# EAGLE schematic main (EAGLE 8.0.2)
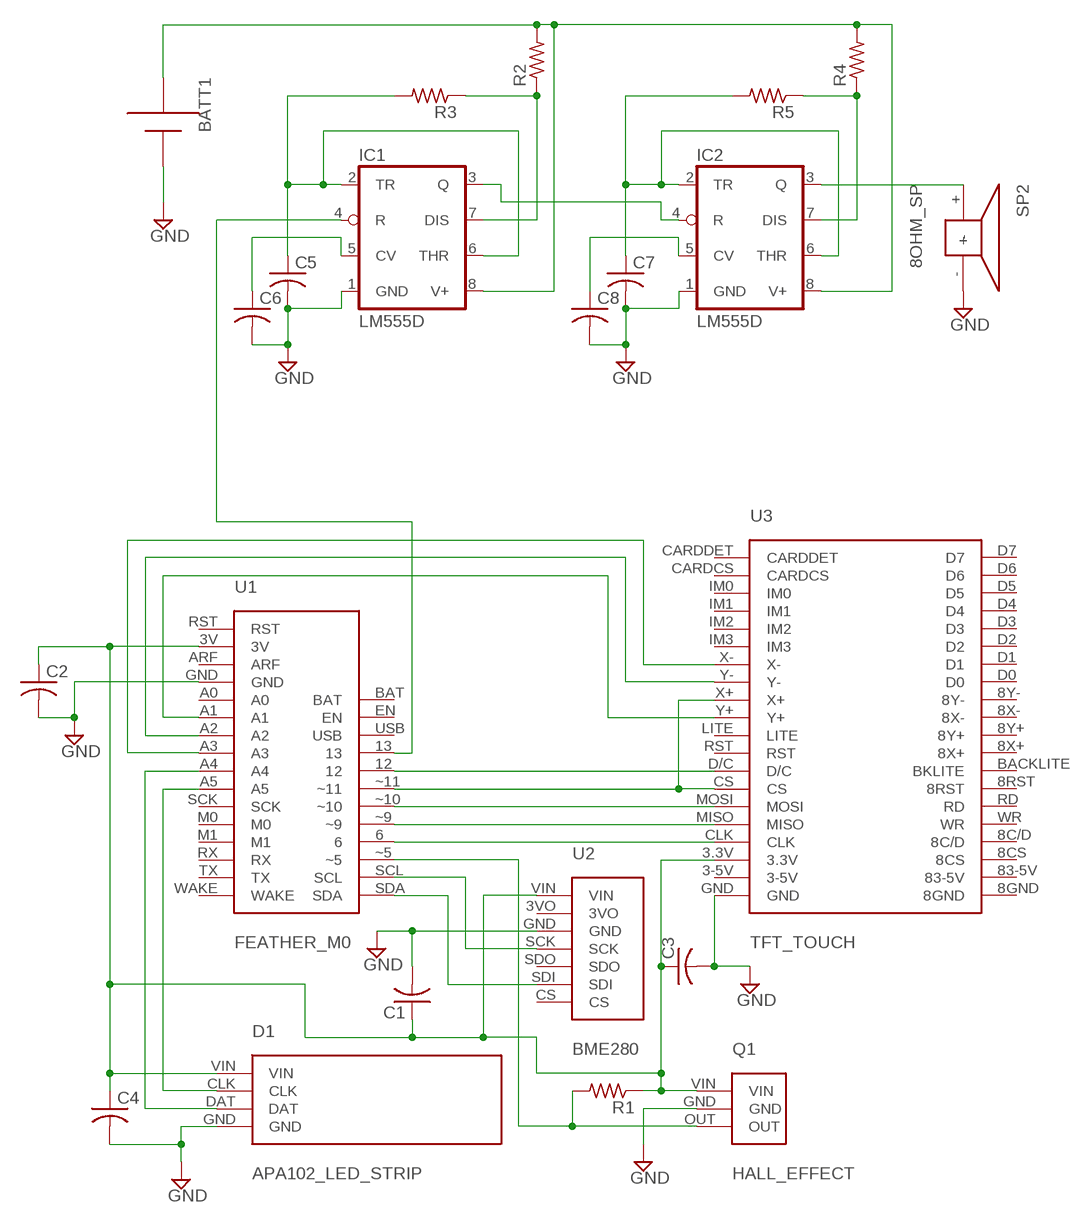
[diagram p0: schematic, sheet 1]

## Parts
BATT1  AAA  [12BH412]
C1  C-US025-024X044  [C025-024X044]
C2  C-US025-024X044  [C025-024X044]
C3  C-US025-024X044  [C025-024X044]
C4  C-US025-024X044  [C025-024X044]
C5  C-US025-024X044  [C025-024X044]
C6  C-US025-024X044  [C025-024X044]
C7  C-US025-024X044  [C025-024X044]
C8  C-US025-024X044  [C025-024X044]
D1  APA102_LED_STRIP  [APA102_LED_STRIP]
IC1  LM555D  [SO08]
IC2  LM555D  [SO08]
Q1  HALL_EFFECT  [HALL_EFFECT]
R1  R-US_0207/5V  [0207/5V]
R2  R-US_0207/5V  [0207/5V]
R3  R-US_0207/5V  [0207/5V]
R4  R-US_0207/5V  [0207/5V]
R5  R-US_0207/5V  [0207/5V]
SP2  8OHM_SP  [8OHM_SP]
U1  FEATHER_M0  [FEATHER_M0]
U2  BME280  [BME280]
U3  TFT_TOUCH  [TFT_TOUCH]

## Nets
GND: BATT1.+ C1.2 C2.2 C3.2 C4.2 C5.2 C6.2 C7.2 C8.2 D1.GND IC1.1(GND) IC2.1(GND) Q1.GND SP2.- U1.GND U2.GND U3.GND
N$1: C5.1 IC1.2(TR) IC1.6(THR) R3.2
N$2: U1.6 U3.CLK
N$3: U1.A1 U3.Y+
N$4: U1.A2 U3.Y-
N$5: U1.~11 U3.CS U3.X+
N$6: U1.12 U3.D/C
N$7: D1.DAT U1.A4
N$8: U1.A3 U3.X-
N$9: D1.CLK U1.A5
N$10: IC2.3(Q) SP2.+
N$11: C1.1 C2.1 C3.1 C4.1 D1.VIN Q1.VIN R1.1 U1.3V U2.VIN U3.3.3V
N$12: Q1.OUT R1.2 U1.~5
N$13: U1.SCL U2.SCK
N$14: U1.SDA U2.SDI
N$15: IC1.7(DIS) R2.1 R3.1
N$16: C6.1 IC1.5(CV)
N$17: C7.1 IC2.2(TR) IC2.6(THR) R5.2
N$18: U1.~9 U3.MISO
N$19: U1.~10 U3.MOSI
N$20: BATT1.- IC1.8(V+) IC2.8(V+) R2.2 R4.2
N$22: IC2.7(DIS) R4.1 R5.1
N$23: C8.1 IC2.5(CV)
N$24: IC1.3(Q) IC2.4(R)
N$28: IC1.4(R) U1.13
Unconnected: U1.A0 U1.ARF U1.BAT U1.EN U1.M0 U1.M1 U1.RST U1.RX U1.SCK U1.TX U1.USB U1.WAKE U2.3VO U2.CS U2.SDO U3.3-5V U3.8C/D U3.8CS U3.8GND U3.8RST U3.8X+ U3.8X- U3.8Y+ U3.8Y- U3.83-5V U3.BACKLITE(BKLITE) U3.CARDCS U3.CARDDET U3.D0 U3.D1 U3.D2 U3.D3 U3.D4 U3.D5 U3.D6 U3.D7 U3.IM0 U3.IM1 U3.IM2 U3.IM3 U3.LITE U3.RD U3.RST U3.WR

## Library data of the parts
BATT1 = adafruit:AAA: AAA PC pin holder Mouser part #12BH412 - but pretty much any 1x AAA battery holder should be the same http://www.ladyada.net/library/pcb/eaglelibrary.html
C1-C8 = rcl:C-US: CAPACITOR, American symbol
D1 = epifib:APA102_LED_STRIP
IC1 IC2 = adafruit:*555: TIMER Changed DIP package to have round (not oval) pin pads http://www.ladyada.net/library/pcb/eaglelibrary.html
Q1 = epifib:HALL_EFFECT
R1-R5 = adafruit:R-US_: RESISTOR, American symbol
SP2 = epifib:8OHM_SP
U1 = epifib:FEATHER_M0
U2 = epifib:BME280
U3 = epifib:TFT_TOUCH